# Altium schematic sheet ADE9153_Circuit.SchDoc
size A
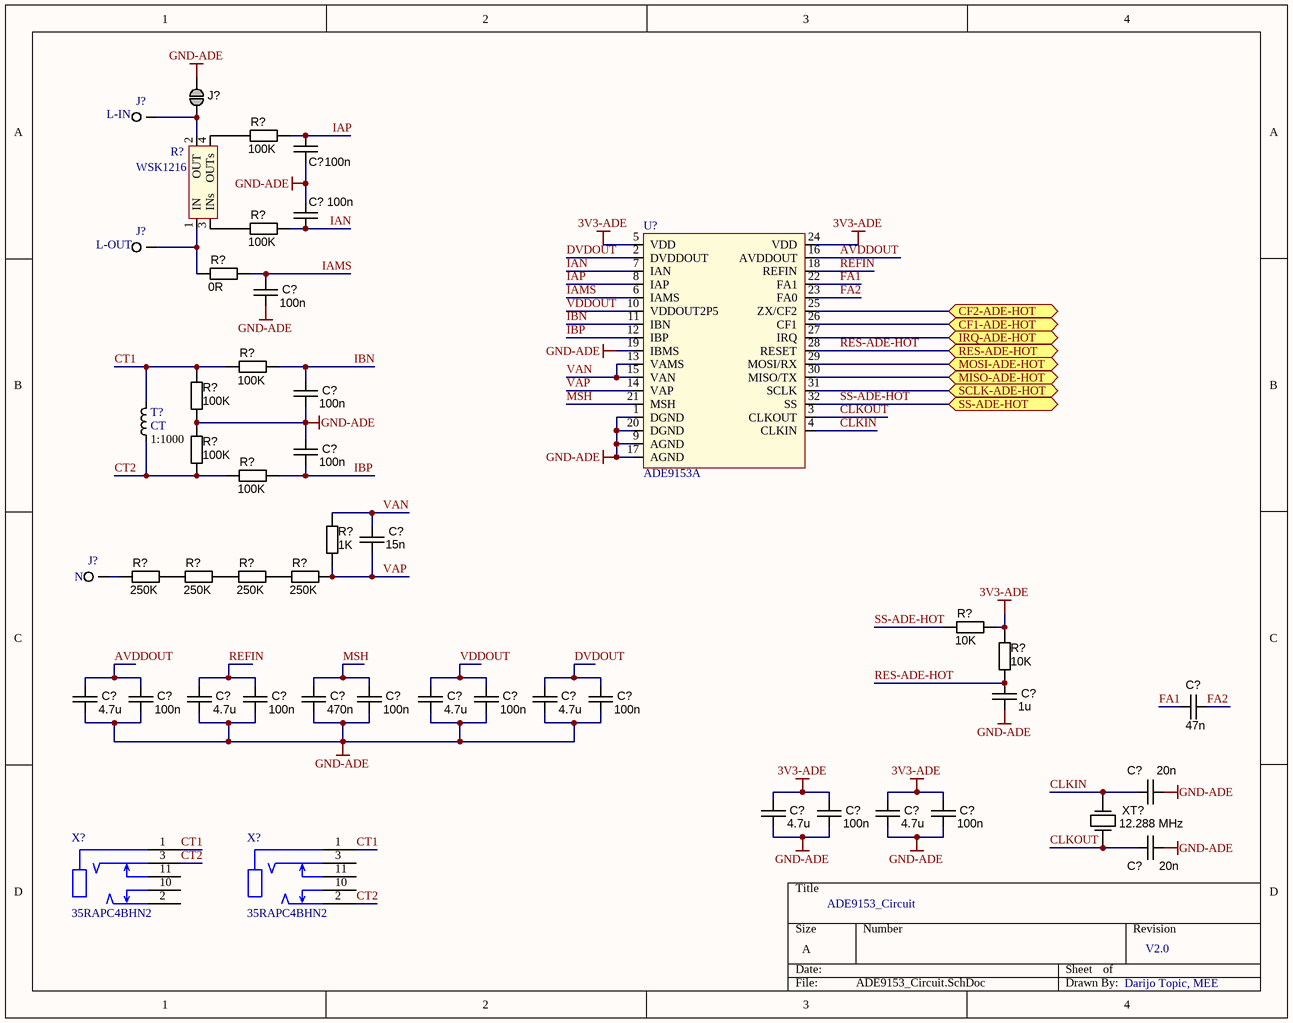
[diagram p0: ADE9153_Circuit.SchDoc]

## Parts
(Parts that share a designator on the sheet are numbered #1, #2 ... from top to bottom, then left to right.)
C?#1  value 100n  [CAPC2012X135N]  (hidden comment: approved sub OK)
C?#2  value 100n  [CAPC2012X135N]  (hidden comment: approved sub OK)
C?#3  value 100n  [CAPC2012X135N]  (hidden comment: approved sub OK)
C?#4  value 100n  [CAPC2012X135N]  (hidden comment: approved sub OK)
C?#5  value 100n  [CAPC2012X135N]  (hidden comment: approved sub OK)
C?#6  value 15n  [CAPC2012X135N]  (hidden comment: approved sub OK)
C?#7  value 1u  [CAPC2012X135N]  (hidden comment: approved sub OK)
C?#8  value 4.7u  [CAPC2012X135N]  (hidden comment: approved sub OK)
C?#9  value 100n  [CAPC2012X135N]  (hidden comment: approved sub OK)
C?#10  value 4.7u  [CAPC2012X135N]  (hidden comment: approved sub OK)
C?#11  value 100n  [CAPC2012X135N]  (hidden comment: approved sub OK)
C?#12  value 470n  [CAPC2012X135N]  (hidden comment: approved sub OK)
C?#13  value 100n  [CAPC2012X135N]  (hidden comment: approved sub OK)
C?#14  value 4.7u  [CAPC2012X135N]  (hidden comment: approved sub OK)
C?#15  value 100n  [CAPC2012X135N]  (hidden comment: approved sub OK)
C?#16  value 4.7u  [CAPC2012X135N]  (hidden comment: approved sub OK)
C?#17  value 100n  [CAPC2012X135N]  (hidden comment: approved sub OK)
C?#18  value 47n  [CAPC2012X135N]  (hidden comment: approved sub OK)
C?#19  value 20n  [CAPC2012X135N]  (hidden comment: approved sub OK)
C?#20  value 4.7u  [CAPC2012X135N]  (hidden comment: approved sub OK)
C?#21  value 100n  [CAPC2012X135N]  (hidden comment: approved sub OK)
C?#22  value 4.7u  [CAPC2012X135N]  (hidden comment: approved sub OK)
C?#23  value 100n  [CAPC2012X135N]  (hidden comment: approved sub OK)
C?#24  value 20n  [CAPC2012X135N]  (hidden comment: approved sub OK)
J?#1  L-IN  [Crimp Spade PCB 6.3mm]
J?#2  Jumper  [HDR1X2]  (value not drawn)  (no BOM)
J?#3  L-OUT  [Crimp Spade PCB 6.3mm]
J?#4  N  [Crimp Spade PCB 6.3mm]
R?#1  value 100K  [RESC2012X70N]  (hidden comment: Thick Film)
R?#2  WSK1216  [WSK1216]
R?#3  value 100K  [RESC2012X70N]  (hidden comment: Thick Film)
R?#4  value 0R  [RESC2012X70N]  (hidden comment: Thick Film)
R?#5  value 100K  [RESC2012X70N]  (hidden comment: Thick Film)
R?#6  value 100K  [RESC2012X70N]  (hidden comment: Thick Film)
R?#7  value 100K  [RESC2012X70N]  (hidden comment: Thick Film)
R?#8  value 100K  [RESC2012X70N]  (hidden comment: Thick Film)
R?#9  value 1K  [RESC2012X70N]  (hidden comment: Thick Film)
R?#10  value 250K  [RESC2012X70N]  (hidden comment: Thick Film)
R?#11  value 250K  [RESC2012X70N]  (hidden comment: Thick Film)
R?#12  value 250K  [RESC2012X70N]  (hidden comment: Thick Film)
R?#13  value 250K  [RESC2012X70N]  (hidden comment: Thick Film)
R?#14  value 10K  [RESC2012X70N]  (hidden comment: Thick Film)
R?#15  value 10K  [RESC2012X70N]  (hidden comment: Thick Film)
T?  CT  Ratio: 1:1000
U?  ADE9153A  [CP-32-12_L]
X?#1  35RAPC4BHN2  [35RAPC _ _ HN2]
X?#2  35RAPC4BHN2  [35RAPC _ _ HN2]
XT?  12.288 MHz  [ABLS7M2]

## Ports
CF1-ADE-HOT (bidir), CF2-ADE-HOT (bidir), IRQ-ADE-HOT (bidir), MISO-ADE-HOT (bidir), MOSI-ADE-HOT (bidir), RES-ADE-HOT (bidir), SCLK-ADE-HOT (bidir), SS-ADE-HOT (bidir)

## Nets
3V3-ADE: C?#20.1 C?#21.1 C?#22.1 C?#23.1 R?#14.1 R?#15.1 U?.5(VDD) U?.24(VDD)
GND-ADE: C?#1.2 C?#2.1 C?#3.2 C?#4.2 C?#5.1 C?#7.2 C?#8.2 C?#9.2 C?#10.2 C?#11.2 C?#12.2 C?#13.2 C?#14.2 C?#15.2 C?#16.2 C?#17.2 C?#19.1 C?#20.2 C?#21.2 C?#22.2 C?#23.2 C?#24.1 J?#2.1 R?#6.2 R?#7.1 U?.1(DGND) U?.9(AGND) U?.17(AGND) U?.19(IBMS) U?.20(DGND)
AVDDOUT: C?#8.1 C?#9.1 U?.16(AVDDOUT)
CF1-ADE-HOT: U?.26(CF1) ; port CF1-ADE-HOT
CF2-ADE-HOT: U?.25(ZX/CF2) ; port CF2-ADE-HOT
CLKIN: C?#19.2 U?.4(CLKIN) XT?.2(OUT)
CLKOUT: C?#24.2 U?.3(CLKOUT) XT?.1(IN)
CT1: R?#5.2 R?#6.1 T?.1 X?#1.1 X?#2.1
CT2: R?#7.2 R?#8.2 T?.2 X?#1.3 X?#2.2
DVDOUT: C?#16.1 C?#17.1 U?.2(DVDDOUT)
FA1: C?#18.1 U?.22(FA1)
FA2: C?#18.2 U?.23(FA0)
IAMS: C?#3.1 R?#4.1 U?.6(IAMS)
IAN: C?#2.2 R?#3.1 U?.7(IAN)
IAP: C?#1.1 R?#1.1 U?.8(IAP)
IBN: C?#4.1 R?#5.1 U?.11(IBN)
IBP: C?#5.2 R?#8.1 U?.12(IBP)
IRQ-ADE-HOT: U?.27(IRQ) ; port IRQ-ADE-HOT
MISO-ADE-HOT: U?.30(MISO/TX) ; port MISO-ADE-HOT
MOSI-ADE-HOT: U?.29(MOSI/RX) ; port MOSI-ADE-HOT
MSH: C?#12.1 C?#13.1 U?.21(MSH)
REFIN: C?#10.1 C?#11.1 U?.18(REFIN)
RES-ADE-HOT: C?#7.1 R?#15.2 U?.28(RESET) ; port RES-ADE-HOT
SCLK-ADE-HOT: U?.31(SCLK) ; port SCLK-ADE-HOT
SS-ADE-HOT: R?#14.2 U?.32(SS) ; port SS-ADE-HOT
VAN: C?#6.1 R?#9.1 U?.13(VAMS) U?.15(VAN)
VAP: C?#6.2 R?#9.2 R?#13.1 U?.14(VAP)
VDDOUT: C?#14.1 C?#15.1 U?.10(VDDOUT2P5)
NetJ?#1_1: J?#1.1 J?#2.2 R?#2.2(OUT)
NetJ?#3_1: J?#3.1 R?#2.1(IN) R?#4.2
NetJ?#4_1: J?#4.1 R?#10.2
NetR?#1_2: R?#1.2 R?#2.4(OUTs)
NetR?#2_3: R?#2.3(INs) R?#3.2

Not connected (* = marked no-connect by the designer): R?#10 1; R?#11 1 2; R?#12 1 2; R?#13 2; X?#1 2 10 11; X?#2 3 10 11

## Notes on the sheet
- ADE9153_Circuit
- V2.0
- Darijo Topic, MEE

## Library data of the parts
C?#1-C?#24 = CAPC_100n_0805_X7R_50V_10%: Capacitor SMD Cer 100nF 10% 50V X7R 0805; Manufacturer 1: Kemet; Manufacturer Part Number 1: C0805C104K5RACTU; Ratings: 50V; X7R; Material: ceramic; SCDType: undef; Package / Case: 0805 (2012 metric); Tolerance: ±10%; Supplier 1: Digi-Key; Supplier Part Number 1: 399-1170-1-ND
J?#1 J?#3 J?#4 = Crimp Spade Connector: Crimp Spade Connector 6.3mm
J?#2 = JUMP1: SMD jumper
R?#1 R?#3-R?#15 = RES_100K_0805_1%: Resistor SMD chip 100k Ohm 0.125W 1% 0805; Manufacturer 1: Vishay/Dale; Manufacturer Part Number 1: CRCW0805100KFKEA; Ratings: 1/8W; SCDType: spec; Package / Case: 0805 (2012 metric); Supplier 1: Digi-Key; Supplier Part Number 1: 541-100KCCT-ND
R?#2 = wsk1216: Power Metal Strip® Resistors, Low Value, / High Power, Surface-Mount, 4-Terminal; Mouser: 71-WSK12161L000FEA
T? = Current Transformer
U? = ADE9153A: Energy Metering IC with Autocalibration; Mouser: 584-ADE9153AACPZ
X?#1 X?#2 = Audio jack 35RAPC4BHN2: Switchcraft 35RAPC4BHN2, 3.5mm stereo jack
XT? = Crystal_6MHz_HC49/US: Resonator Ceramic 6.00 MHz 30ppm; Manufacturer 1: CTS-Frequency Controls; Manufacturer Part Number 1: ATS060BSM-1; Frequency: 6MHz; Frequency Stability: ±50ppm; Load Capacitance: 18pF; Operating Mode: Fundamental; Parameter Name: 0.169" (4.30mm); SCDType: spec; Package / Case: HC49/US-SM; Ratings: 6.00 MHz; Supplier 1: Digi-Key; Supplier Part Number 1: CTX882CT-ND; Type: MHz Crystal; Frequency Tolerance: ±30ppm; Operating Temperature: -20°C ~ 70°C; Mounting Type: Surface Mount; Size / Dimension: 0.437" L x 0.190" W (11.10mm x 4.83mm); ComponentLink1URL: http://www.ctscorp.com/components/Datasheets/008-0309-0.pdf; ComponentLink1Description: http://www.ctscorp.com/components/Datasheets/008-0309-0.pdf